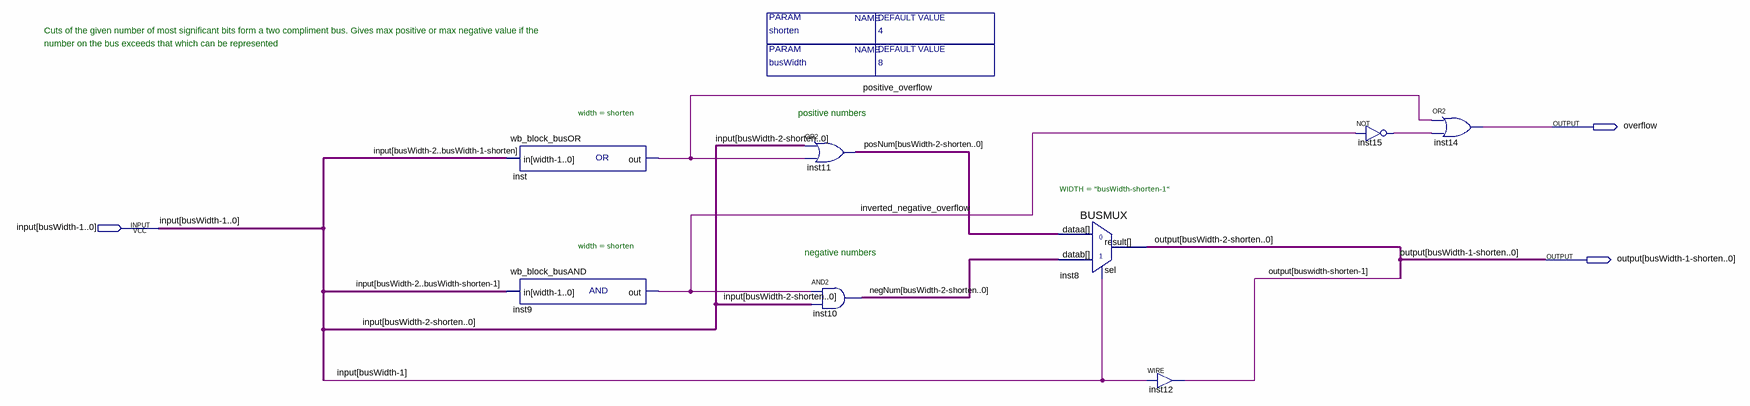
[diagram p0: schematic sheet]
// Quartus schematic wb_aComp_twoComplBitClipping.bdf as structural Verilog: 8 symbols, 3 pins
module wb_aComp_twoComplBitClipping #(parameter shorten = 4, parameter busWidth = 8) (
  input  [7:0] \input ,
  output overflow,
  output [3:0] \output 
);

  wire inst15_out, inverted_negative_overflow, positive_overflow;
  wire [2:0] negNum, posNum;

  wb_block_busOR #(.width(shorten)) inst (.in(\input [6:3]), .out(positive_overflow));
  wb_block_busAND #(.width(shorten)) inst9 (.in(\input [6:3]), .out(inverted_negative_overflow));
  assign posNum = \input [2:0] | {3{positive_overflow}};  // OR2 inst11, 3 bits wide
  assign negNum = {3{inverted_negative_overflow}} & \input [2:0];  // AND2 inst10, 3 bits wide
  BUSMUX #(.WIDTH("busWidth-shorten-1")) inst8 (
    .datab(negNum), .sel(\input [7]), .dataa(posNum), .result(\output [2:0]));
  assign \output [3] = \input [7];  // WIRE inst12
  not inst15 (inst15_out, inverted_negative_overflow);
  or inst14 (overflow, positive_overflow, inst15_out);

  // Notes on the sheet:
  //   Cuts of the given number of most significant bits form a two compliment bus. Gives max positive or max negative value if the
  //   number on the bus exceeds that which can be represented
  //   positive numbers
  //   negative numbers
endmodule
